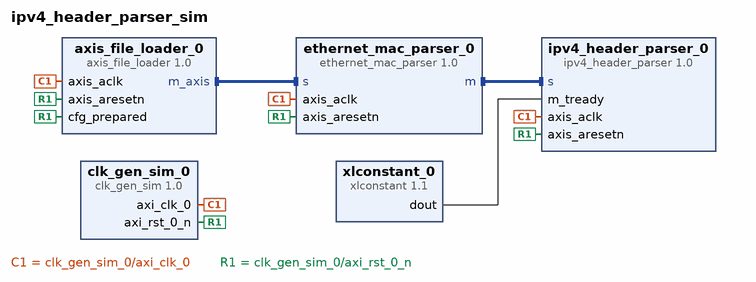
[diagram p0: block diagram of the top level]
# Vivado block design ipv4_header_parser_sim, xc7vx690tffg1927-2, Vivado 2019.1
create_bd_design ipv4_header_parser_sim

create_bd_cell -type ip -vlnv user.org:user:ipv4_header_parser:1.0 ipv4_header_parser_0
create_bd_cell -type ip -vlnv xilinx.com:ip:clk_gen_sim:1.0 clk_gen_sim_0
set_property -dict {CONFIG.USER_AXI_CLK_0_FREQ 100} [get_bd_cells clk_gen_sim_0]
create_bd_cell -type ip -vlnv user.org:user:axis_file_loader:1.0 axis_file_loader_0
create_bd_cell -type ip -vlnv xilinx.com:ip:xlconstant:1.1 xlconstant_0
create_bd_cell -type ip -vlnv user.org:user:ethernet_mac_parser:1.0 ethernet_mac_parser_0

# ---- connections ----

connect_bd_intf_net [get_bd_intf_pins axis_file_loader_0/m_axis] [get_bd_intf_pins ethernet_mac_parser_0/s]
connect_bd_intf_net [get_bd_intf_pins ethernet_mac_parser_0/m] [get_bd_intf_pins ipv4_header_parser_0/s]
connect_bd_net [get_bd_pins clk_gen_sim_0/axi_clk_0] \
  [get_bd_pins axis_file_loader_0/axis_aclk] [get_bd_pins ipv4_header_parser_0/axis_aclk] \
  [get_bd_pins ethernet_mac_parser_0/axis_aclk]
connect_bd_net [get_bd_pins clk_gen_sim_0/axi_rst_0_n] \
  [get_bd_pins axis_file_loader_0/axis_aresetn] [get_bd_pins ipv4_header_parser_0/axis_aresetn] \
  [get_bd_pins axis_file_loader_0/cfg_prepared] [get_bd_pins ethernet_mac_parser_0/axis_aresetn]
connect_bd_net [get_bd_pins xlconstant_0/dout] [get_bd_pins ipv4_header_parser_0/m_tready]

validate_bd_design
save_bd_design
